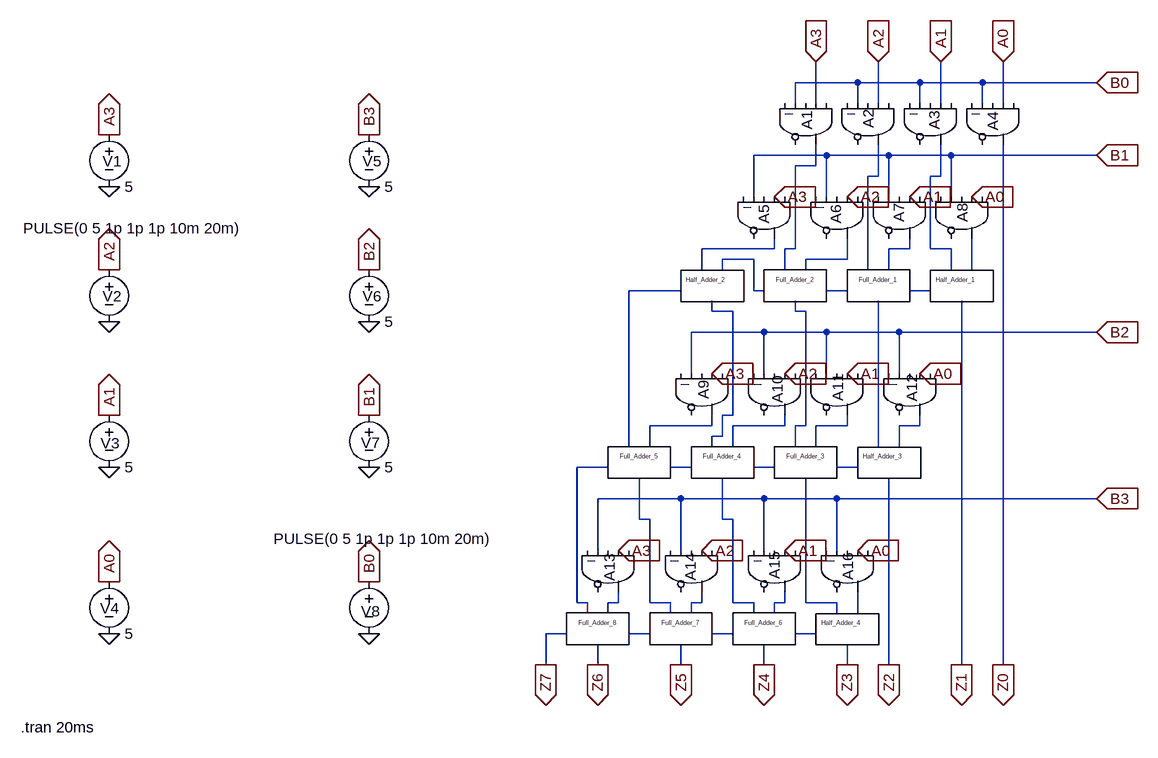
[diagram p0: schematic Multiplier.asc]
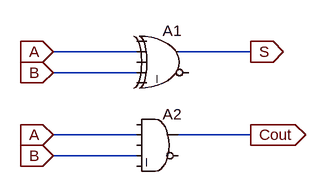
[diagram p1: sub-circuit half_adder.asc]
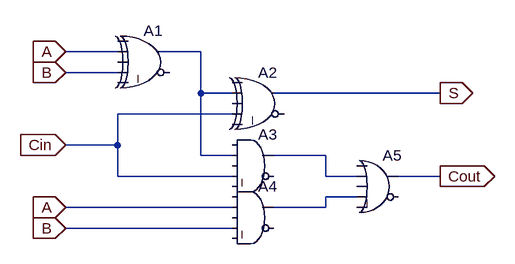
[diagram p2: sub-circuit full_adder.asc]
Multiplier.asc, the LTspice schematic file:
Version 4
SHEET 1 880 1040
WIRE 224 32 128 32
WIRE 320 32 224 32
WIRE 416 32 320 32
WIRE 592 32 416 32
WIRE 128 64 128 32
WIRE 160 64 160 0
WIRE 224 64 224 32
WIRE 256 64 256 0
WIRE 320 64 320 32
WIRE 352 64 352 0
WIRE 416 64 416 32
WIRE 448 64 448 0
WIRE 176 144 64 144
WIRE 272 144 176 144
WIRE 368 144 272 144
WIRE 592 144 368 144
WIRE 160 160 160 128
WIRE 160 160 128 160
WIRE 256 176 256 128
WIRE 256 176 240 176
WIRE 352 176 352 128
WIRE 352 176 336 176
WIRE 64 208 64 144
WIRE 176 208 176 144
WIRE 272 208 272 144
WIRE 368 208 368 144
WIRE 96 288 96 272
WIRE 96 288 -16 288
WIRE 128 288 128 160
WIRE 128 288 112 288
WIRE 304 288 304 272
WIRE 304 288 272 288
WIRE 336 288 336 176
WIRE 368 288 336 288
WIRE 64 304 16 304
WIRE 208 304 208 272
WIRE 208 304 144 304
WIRE -16 320 -16 288
WIRE 16 320 16 304
WIRE 112 320 112 288
WIRE 144 320 144 304
WIRE 240 320 240 176
WIRE 272 320 272 288
WIRE 368 320 368 288
WIRE 400 320 400 272
WIRE -48 352 -128 352
WIRE 64 352 64 304
WIRE 80 352 64 352
WIRE 208 352 176 352
WIRE 336 352 304 352
WIRE 0 384 0 368
WIRE 32 384 0 384
WIRE 128 384 128 368
WIRE 144 384 128 384
WIRE 80 416 -32 416
WIRE 176 416 80 416
WIRE 288 416 176 416
WIRE 592 416 288 416
WIRE -32 480 -32 416
WIRE 80 480 80 416
WIRE 176 480 176 416
WIRE 288 480 288 416
WIRE 32 544 32 384
WIRE 32 544 16 544
WIRE 0 560 0 544
WIRE 0 560 -96 560
WIRE 112 560 112 544
WIRE 112 560 32 560
WIRE 144 560 144 384
WIRE 144 560 128 560
WIRE 208 560 208 544
WIRE 208 560 160 560
WIRE 320 560 320 544
WIRE 320 560 288 560
WIRE 16 576 16 544
WIRE 16 576 0 576
WIRE -128 592 -128 352
WIRE -96 592 -96 560
WIRE 0 592 0 576
WIRE 32 592 32 560
WIRE 128 592 128 560
WIRE 160 592 160 560
WIRE 256 592 256 368
WIRE 288 592 288 560
WIRE -160 624 -208 624
WIRE -32 624 -64 624
WIRE 96 624 64 624
WIRE 224 624 192 624
WIRE -48 672 -176 672
WIRE 80 672 -48 672
WIRE 192 672 80 672
WIRE 592 672 192 672
WIRE -112 704 -112 640
WIRE -96 704 -112 704
WIRE 16 704 16 640
WIRE 32 704 16 704
WIRE -176 752 -176 672
WIRE -48 752 -48 672
WIRE 80 752 80 672
WIRE 192 752 192 672
WIRE -208 832 -208 624
WIRE -192 832 -208 832
WIRE -144 832 -144 816
WIRE -144 832 -160 832
WIRE -96 832 -96 704
WIRE -64 832 -96 832
WIRE -16 832 -16 816
WIRE -16 832 -32 832
WIRE 32 832 32 704
WIRE 64 832 32 832
WIRE 112 832 112 816
WIRE 112 832 96 832
WIRE 144 832 144 640
WIRE 192 832 144 832
WIRE -192 848 -192 832
WIRE -160 848 -160 832
WIRE -64 848 -64 832
WIRE -32 848 -32 832
WIRE 64 848 64 832
WIRE 96 848 96 832
WIRE 192 848 192 832
WIRE 224 848 224 816
WIRE -224 880 -256 880
WIRE -96 880 -128 880
WIRE 32 880 0 880
WIRE 160 880 128 880
WIRE -256 928 -256 880
WIRE -176 928 -176 896
WIRE -48 928 -48 896
WIRE 80 928 80 896
WIRE 208 928 208 896
WIRE 272 928 272 640
WIRE 384 928 384 368
WIRE 448 928 448 128
FLAG 96 208 A3
IOPIN 96 208 In
FLAG 208 208 A2
IOPIN 208 208 In
FLAG 304 208 A1
IOPIN 304 208 In
FLAG 400 208 A0
IOPIN 400 208 In
FLAG 592 32 B0
IOPIN 592 32 In
FLAG 592 144 B1
IOPIN 592 144 In
FLAG 592 416 B2
IOPIN 592 416 In
FLAG 0 480 A3
IOPIN 0 480 In
FLAG 112 480 A2
IOPIN 112 480 In
FLAG 208 480 A1
IOPIN 208 480 In
FLAG 320 480 A0
IOPIN 320 480 In
FLAG -144 752 A3
IOPIN -144 752 In
FLAG -16 752 A2
IOPIN -16 752 In
FLAG 112 752 A1
IOPIN 112 752 In
FLAG 224 752 A0
IOPIN 224 752 In
FLAG 592 672 B3
IOPIN 592 672 In
FLAG -176 928 Z6
IOPIN -176 928 Out
FLAG 448 928 Z0
IOPIN 448 928 Out
FLAG 384 928 Z1
IOPIN 384 928 Out
FLAG 272 928 Z2
IOPIN 272 928 Out
FLAG 208 928 Z3
IOPIN 208 928 Out
FLAG 80 928 Z4
IOPIN 80 928 Out
FLAG -48 928 Z5
IOPIN -48 928 Out
FLAG -256 928 Z7
IOPIN -256 928 Out
FLAG -928 192 0
FLAG -528 192 0
FLAG -928 400 0
FLAG -528 400 0
FLAG -528 624 0
FLAG -928 624 0
FLAG -928 880 0
FLAG -528 880 0
FLAG -928 112 A3
IOPIN -928 112 Out
FLAG -928 320 A2
IOPIN -928 320 Out
FLAG -928 544 A1
IOPIN -928 544 Out
FLAG -928 800 A0
IOPIN -928 800 Out
FLAG -528 800 B0
IOPIN -528 800 Out
FLAG -528 544 B1
IOPIN -528 544 Out
FLAG -528 320 B2
IOPIN -528 320 Out
FLAG -528 112 B3
IOPIN -528 112 Out
FLAG 160 0 A3
IOPIN 160 0 In
FLAG 256 0 A2
IOPIN 256 0 In
FLAG 352 0 A1
IOPIN 352 0 In
FLAG 448 0 A0
IOPIN 448 0 In
SYMBOL Digital\\and 208 96 R90
WINDOW 0 -21 62 Left 2
SYMATTR InstName A1
SYMBOL Digital\\and 304 96 R90
WINDOW 0 -23 63 Left 2
SYMATTR InstName A2
SYMBOL Digital\\and 400 96 R90
WINDOW 0 -21 58 Left 2
SYMATTR InstName A3
SYMBOL Digital\\and 496 96 R90
WINDOW 0 -19 64 Left 2
SYMATTR InstName A4
SYMBOL Digital\\and 144 240 R90
WINDOW 0 -20 64 Left 2
SYMATTR InstName A5
SYMBOL Digital\\and 256 240 R90
WINDOW 0 -20 65 Left 2
SYMATTR InstName A6
SYMBOL Digital\\and 352 240 R90
WINDOW 0 -22 64 Left 2
SYMATTR InstName A7
SYMBOL Digital\\and 448 240 R90
WINDOW 0 -22 63 Left 2
SYMATTR InstName A8
SYMBOL Half_Adder 384 352 R0
SYMATTR InstName Half_Adder_1
SYMBOL Half_Adder 0 352 R0
SYMATTR InstName Half_Adder_2
SYMBOL Full_Adder 256 352 R0
WINDOW 0 -30 -17 Left 0
SYMATTR InstName Full_Adder_1
SYMBOL Full_Adder 128 352 R0
WINDOW 0 -30 -17 Left 0
SYMATTR InstName Full_Adder_2
SYMBOL Digital\\and 48 512 R90
WINDOW 0 -22 61 Left 2
SYMATTR InstName A9
SYMBOL Digital\\and 160 512 R90
WINDOW 0 -29 59 Left 2
SYMATTR InstName A10
SYMBOL Digital\\and 256 512 R90
WINDOW 0 -32 62 Left 2
SYMATTR InstName A11
SYMBOL Digital\\and 368 512 R90
WINDOW 0 -31 60 Left 2
SYMATTR InstName A12
SYMBOL Half_Adder 272 624 R0
SYMATTR InstName Half_Adder_3
SYMBOL Full_Adder 144 624 R0
WINDOW 0 -30 -17 Left 0
SYMATTR InstName Full_Adder_3
SYMBOL Full_Adder 16 624 R0
WINDOW 0 -30 -17 Left 0
SYMATTR InstName Full_Adder_4
SYMBOL Full_Adder -112 624 R0
WINDOW 0 -30 -17 Left 0
SYMATTR InstName Full_Adder_5
SYMBOL Digital\\and -96 784 R90
WINDOW 0 -27 62 Left 2
SYMATTR InstName A13
SYMBOL Digital\\and 32 784 R90
WINDOW 0 -28 65 Left 2
SYMATTR InstName A14
SYMBOL Digital\\and 160 784 R90
WINDOW 0 -30 64 Left 2
SYMATTR InstName A15
SYMBOL Digital\\and 272 784 R90
WINDOW 0 -29 63 Left 2
SYMATTR InstName A16
SYMBOL Half_Adder 208 880 R0
SYMATTR InstName Half_Adder_4
SYMBOL Full_Adder 80 880 R0
WINDOW 0 -30 -17 Left 0
SYMATTR InstName Full_Adder_6
SYMBOL Full_Adder -48 880 R0
WINDOW 0 -30 -17 Left 0
SYMATTR InstName Full_Adder_7
SYMBOL Full_Adder -176 880 R0
WINDOW 0 -30 -17 Left 0
SYMATTR InstName Full_Adder_8
SYMBOL voltage -928 96 R0
WINDOW 0 -10 57 Left 2
WINDOW 123 0 0 Left 0
WINDOW 39 0 0 Left 0
SYMATTR InstName V1
SYMATTR Value 5
SYMBOL voltage -928 304 R0
WINDOW 0 -10 57 Left 2
WINDOW 3 -132 -48 Left 2
WINDOW 123 0 0 Left 0
WINDOW 39 0 0 Left 0
SYMATTR InstName V2
SYMATTR Value PULSE(0 5 1p 1p 1p 10m 20m)
SYMBOL voltage -928 528 R0
WINDOW 0 -13 59 Left 2
WINDOW 123 0 0 Left 0
WINDOW 39 0 0 Left 0
SYMATTR InstName V3
SYMATTR Value 5
SYMBOL voltage -928 784 R0
WINDOW 0 -14 57 Left 2
WINDOW 123 0 0 Left 0
WINDOW 39 0 0 Left 0
SYMATTR InstName V4
SYMATTR Value 5
SYMBOL voltage -528 96 R0
WINDOW 0 -10 57 Left 2
WINDOW 123 0 0 Left 0
WINDOW 39 0 0 Left 0
SYMATTR InstName V5
SYMATTR Value 5
SYMBOL voltage -528 304 R0
WINDOW 0 -10 57 Left 2
WINDOW 123 0 0 Left 0
WINDOW 39 0 0 Left 0
SYMATTR InstName V6
SYMATTR Value 5
SYMBOL voltage -528 528 R0
WINDOW 0 -12 58 Left 2
WINDOW 123 0 0 Left 0
WINDOW 39 0 0 Left 0
SYMATTR InstName V7
SYMATTR Value 5
SYMBOL voltage -528 784 R0
WINDOW 0 -12 61 Left 2
WINDOW 3 -147 -50 Left 2
WINDOW 123 0 0 Left 0
WINDOW 39 0 0 Left 0
SYMATTR InstName V8
SYMATTR Value PULSE(0 5 1p 1p 1p 10m 20m)
TEXT -1064 1024 Left 2 !.tran 20ms

half_adder.asc, the sub-circuit schematic file:
Version 4
SHEET 1 880 680
WIRE 128 80 0 80
WIRE 304 80 192 80
WIRE 128 112 0 112
WIRE 128 208 0 208
WIRE 304 208 192 208
WIRE 128 240 0 240
FLAG 0 80 A
IOPIN 0 80 In
FLAG 0 208 A
IOPIN 0 208 In
FLAG 0 112 B
IOPIN 0 112 In
FLAG 0 240 B
IOPIN 0 240 In
FLAG 304 80 S
IOPIN 304 80 Out
FLAG 304 208 Cout
IOPIN 304 208 Out
SYMBOL Digital\\xor 176 32 R0
SYMATTR InstName A1
SYMBOL Digital\\and 160 160 R0
SYMATTR InstName A2

full_adder.asc, the sub-circuit schematic file:
Version 4
SHEET 1 880 680
WIRE 64 48 -16 48
WIRE 192 48 128 48
WIRE 64 80 -16 80
WIRE 192 112 192 48
WIRE 240 112 192 112
WIRE 560 112 304 112
WIRE 240 144 64 144
WIRE 64 192 64 144
WIRE 64 192 -16 192
WIRE 192 208 192 112
WIRE 240 208 192 208
WIRE 384 208 304 208
WIRE 64 240 64 192
WIRE 240 240 64 240
WIRE 384 240 384 208
WIRE 432 240 384 240
WIRE 560 240 496 240
WIRE 432 272 384 272
WIRE 240 288 -16 288
WIRE 384 288 384 272
WIRE 384 288 304 288
WIRE 240 320 -16 320
FLAG -16 48 A
IOPIN -16 48 In
FLAG -16 80 B
IOPIN -16 80 In
FLAG -16 192 Cin
IOPIN -16 192 In
FLAG -16 288 A
IOPIN -16 288 In
FLAG -16 320 B
IOPIN -16 320 In
FLAG 560 112 S
IOPIN 560 112 Out
FLAG 560 240 Cout
IOPIN 560 240 Out
SYMBOL Digital\\xor 112 0 R0
SYMATTR InstName A1
SYMBOL Digital\\xor 288 64 R0
SYMATTR InstName A2
SYMBOL Digital\\and 272 160 R0
SYMATTR InstName A3
SYMBOL Digital\\and 272 240 R0
SYMATTR InstName A4
SYMBOL Digital\\or 464 192 R0
SYMATTR InstName A5

The netlist it stands for:
* Multiplier.asc
A1 0 A3 0 B0 0 0 N001 0 AND
A2 0 A2 0 B0 0 0 N002 0 AND
A3 0 A1 0 B0 0 0 N003 0 AND
A4 0 A0 0 B0 0 0 Z0 0 AND
A5 0 A3 0 B1 0 0 N004 0 AND
A6 0 A2 0 B1 0 0 N007 0 AND
A7 0 A1 0 B1 0 0 N005 0 AND
A8 0 A0 0 B1 0 0 N008 0 AND
XHalf_Adder_1 N003 N008 N011 Z1 half_adder
XHalf_Adder_2 N004 N006 N009 N012 half_adder
XFull_Adder_1 N002 N005 N011 N010 N018 full_adder
XFull_Adder_2 N001 N007 N010 N006 N013 full_adder
A9 0 A3 0 B2 0 0 N014 0 AND
A10 0 A2 0 B2 0 0 N015 0 AND
A11 0 A1 0 B2 0 0 N016 0 AND
A12 0 A0 0 B2 0 0 N017 0 AND
XHalf_Adder_3 N018 N017 N022 Z2 half_adder
XFull_Adder_3 N013 N016 N022 N021 N028 full_adder
XFull_Adder_4 N012 N015 N021 N020 N024 full_adder
XFull_Adder_5 N009 N014 N020 N019 N023 full_adder
A13 0 A3 0 B3 0 0 N025 0 AND
A14 0 A2 0 B3 0 0 N026 0 AND
A15 0 A1 0 B3 0 0 N027 0 AND
A16 0 A0 0 B3 0 0 N029 0 AND
XHalf_Adder_4 N028 N029 N032 Z3 half_adder
XFull_Adder_6 N024 N027 N032 N031 Z4 full_adder
XFull_Adder_7 N023 N026 N031 N030 Z5 full_adder
XFull_Adder_8 N019 N025 N030 Z7 Z6 full_adder
V1 A3 0 5
V2 A2 0 PULSE(0 5 1p 1p 1p 10m 20m)
V3 A1 0 5
V4 A0 0 5
V5 B3 0 5
V6 B2 0 5
V7 B1 0 5
V8 B0 0 PULSE(0 5 1p 1p 1p 10m 20m)

* block symbol definitions
.subckt half_adder A B Cout S
A1 0 A 0 B 0 0 S 0 XOR
A2 0 A 0 B 0 0 Cout 0 AND
.ends half_adder

.subckt full_adder A B Cin Cout S
A1 0 A 0 B 0 0 N001 0 XOR
A2 0 N001 0 Cin 0 0 S 0 XOR
A3 0 N001 0 Cin 0 0 N002 0 AND
A4 0 A 0 B 0 0 N003 0 AND
A5 0 N002 0 N003 0 0 Cout 0 OR
.ends full_adder

.tran 20ms
.backanno
.end